# EAGLE design SimulatorT2GenericSensorRevC (EAGLE 7.7.0)
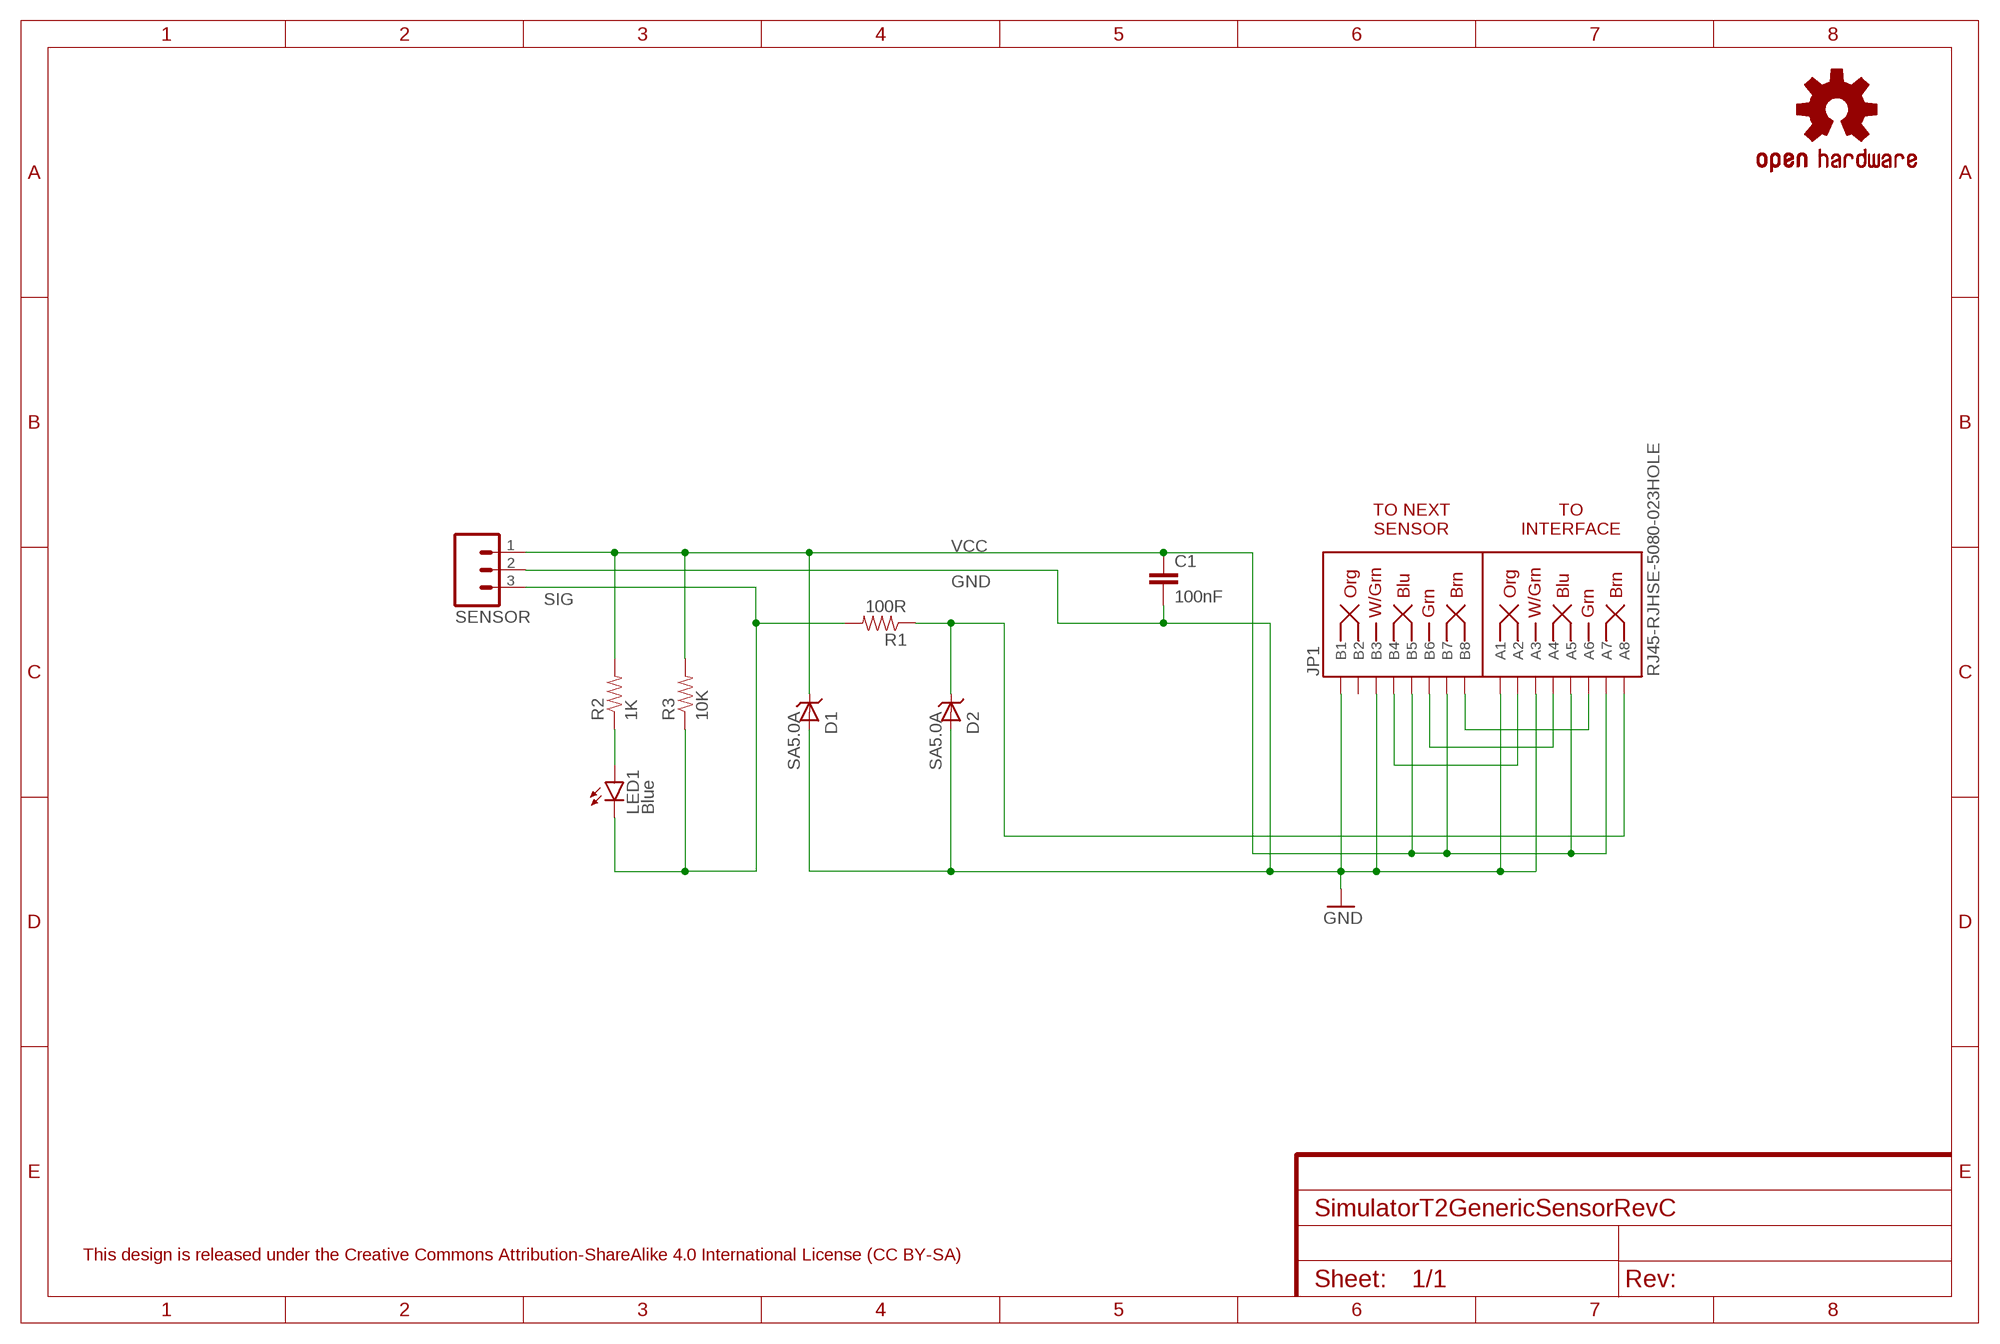
[diagram p0: schematic, sheet 1]
FRAME1 (FRAME-A4L): CNAME: Liverpool Simulator Type 2 Generic Sensor; CREVISION: Rev C 01/2018; DESIGNER: A J Instone-Cowie

## Parts
C1  100nF  CAPPTH  [CAP-PTH-SMALL]
D1  SA5.0A  [DO41_TVS_UNI]
D2  SA5.0A  [DO41_TVS_UNI]
JP1  RJ45-RJHSE-5080-023HOLE  [RJ45-RJHSE-5080-02-3HOLE]
LED1  Blue  LED3MM  [LED3MM]
LOGO1  OSHW-LOGOS  [OSHW-LOGO-S]
R1  100R  RESISTORPTH-1/4W  [AXIAL-0.4]
R2  1K  RESISTORPTH-1/4W  [AXIAL-0.4]
R3  10K  RESISTORPTH-1/4W  [AXIAL-0.4]
SENSOR  M03PTH  [1X03]

## Nets
!OUT!: D2.CATHODE JP1.A8 R1.P$1
B2: JP1.A6 JP1.B8
B3: JP1.A4 JP1.B6
B4: JP1.A2 JP1.B4
GND: C1.2 D1.ANODE D2.ANODE JP1.A1 JP1.A3 JP1.B1 JP1.B3 SENSOR.2
LED: LED1.A R2.P$1
SIG: LED1.K(C) R1.P$2 R3.P$1 SENSOR.3
VCC: C1.1 D1.CATHODE JP1.A5 JP1.A7 JP1.B5 JP1.B7 R2.P$2 R3.P$2 SENSOR.1
Unconnected: JP1.B2

## Notes on the sheet
- TO NEXT
  SENSOR
- TO
  INTERFACE
- This design is released under the Creative Commons Attribution-ShareAlike 4.0 International License (CC BY-SA)

## Library data of the parts
C1 = SparkFun-Passives:CAP: Capacitor Standard 0603 ceramic capacitor, and 0.1" leaded capacitor.
D1 D2 = AIC_Custom:SA5.0A: SA5.0CA TVS Uni-Directional Transient Voltage Suppressor. 5V, DO41 package
JP1 = AIC_Custom:RJ45-RJHSE-5080-02: Amphenol RJHSE-x080 RJ45 PCB Jack (2-Port) RJ45 8-pin connection PCB PTH connector, 2-Port 90 degree package 3 Hole variant has extra hole to allow a single port socket to fitted to position A if position B is not required.
LED1 = SparkFun-LED:LED: LEDs Standard schematic elements and footprints for 5mm, 3mm, 1206, and 0603 sized LEDs. 5mm - Spark Fun Electronics SKU : COM-00529 (and others)
LOGO1 = SparkFun-Aesthetics:OSHW-LOGO: Open Source Hardware Logo This logo indicates the piece of hardware it is found on incorporates a OSHW license and/or adheres to the definition of open source hardware found here: http://freedomdefined.org/OSHW
R1-R3 = SparkFun-Passives:RESISTOR: Resistor Basic schematic elements and footprints for 0603, 1206, and PTH resistors.
SENSOR = SparkFun-Connectors:M03: Header 3 Standard 3-pin 0.1" header. Use with straight break away headers (SKU : PRT-00116), right angle break away headers (PRT-00553), swiss pins (PRT-00743), machine pins (PRT-00117), and female headers (PRT-00115). Molex polarized connector foot print use with SKU : PRT-08232 with associated crimp pins and housings.

## Board
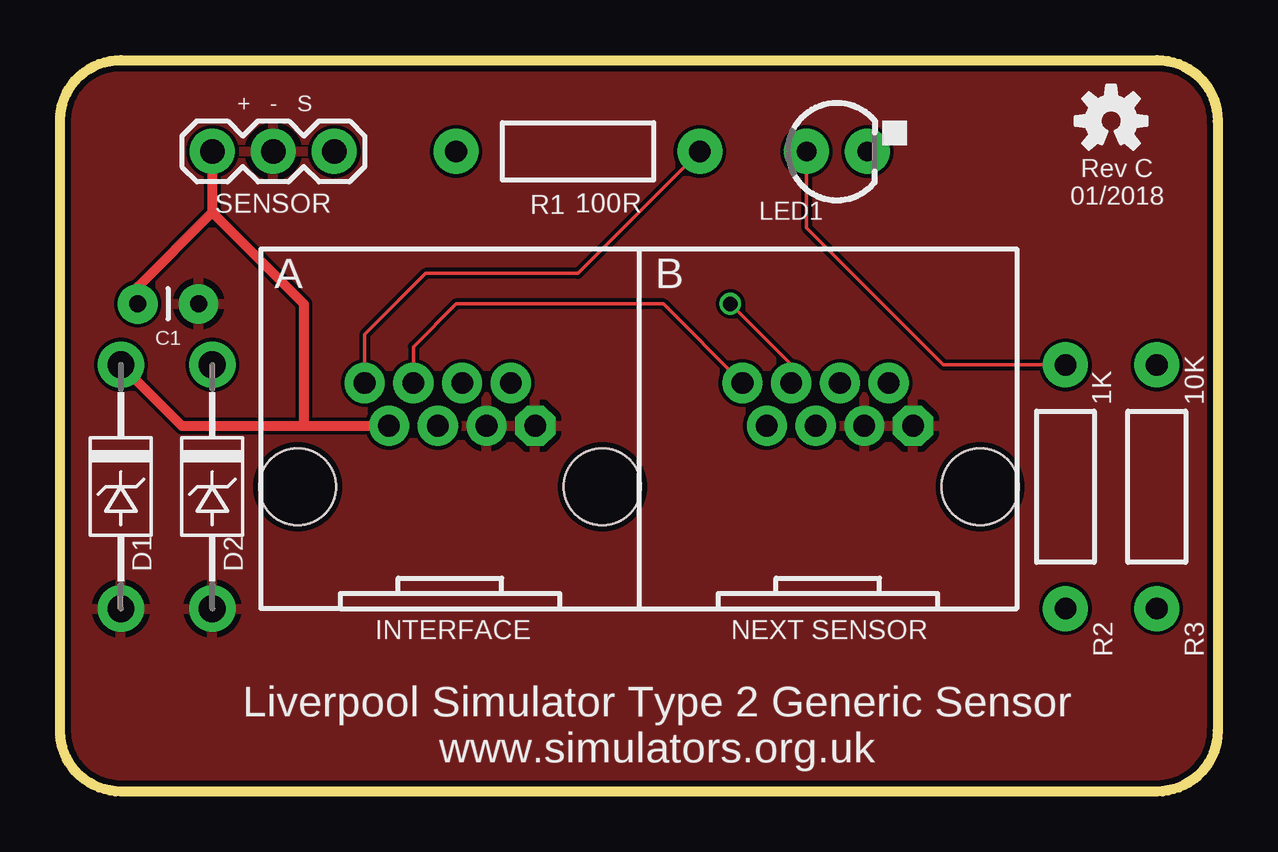
[diagram p1: board, top side]
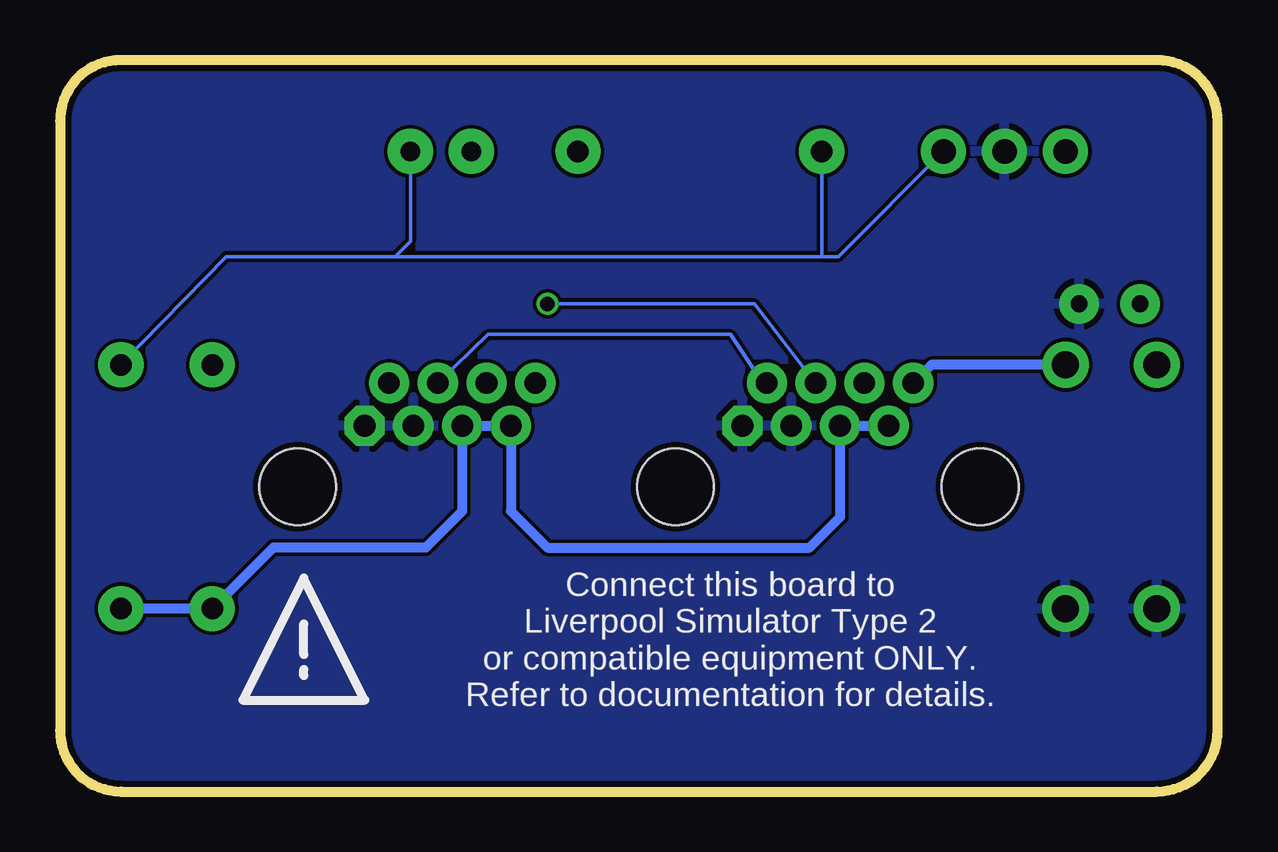
[diagram p2: board, bottom side, seen from below]

Size 48.26 x 30.48 mm. Coordinates in mm from the lower left corner, seen from the top.
Outline: 2.54,30.48 45.72,30.48 arc-90 48.26,27.94 48.26,2.54 arc-90 45.72,0 2.54,0 arc-90 0,2.54 0,27.94 arc-90 2.54,30.48
Copper layers (1*16): Top 0.035mm / dielectric 1.5mm / Bottom 0.035mm
Design rules "SeeedStudio_2layer_DRU_no_angle_20140221": minimum track width 6mil, minimum drill 12mil, track to track 6mil, track to pad 6mil, pad to pad 6mil, via to via 6mil, smd to smd 0mil, copper to edge 10mil, drill to drill 10mil, minimum pad ring 10mil, minimum via ring 6mil, stop-mask expansion 2mil, vias tented up to drill 100mil, thermal gap 10mil

### Footprints (pad centres in the part's own frame; a part is rotated, then mirrored left to right if it is on the bottom)
CAP-PTH-SMALL = drill 0.7 pad 1.651: 1 0,0; 2 2.54,0
DO41_TVS_UNI = drill 1.118 pad 1.93: ANODE -5.08,0; CATHODE 5.08,0
RJ45-RJHSE-5080-02-3HOLE = drill 0.9 pad 1.676 octagon: A1 -4.318,2.54; B1 11.43,2.54 | drill 0.9 pad 1.676: A2 -5.334,4.318; A3 -6.35,2.54; A4 -7.366,4.318; A5 -8.382,2.54; A6 -9.398,4.318; A7 -10.414,2.54; A8 -11.43,4.318; B2 10.414,4.318; B3 9.398,2.54; B4 8.382,4.318; B5 7.366,2.54; B6 6.35,4.318; B7 5.334,2.54; B8 4.318,4.318 | hole 3.2: -14.224,0; 14.224,0; -1.524,0
LED3MM = drill 0.813 pad 1.88: A -1.27,0; K 1.27,0
AXIAL-0.4 = drill 0.9 pad 1.88: P$1 -5.08,0; P$2 5.08,0
1X03 = drill 1.016 pad 1.88: 1 0,0; 2 2.54,0; 3 5.08,0

### Placement (x,y rotation side)
C1  3.24,20.32 0 top
D1  2.54,12.7 90 top
D2  6.35,12.7 90 top
JP1  24.13,12.7 0 top
LED1  32.38,26.67 0 top
LOGO1  43.81,27.94 0 top
R1  21.59,26.67 180 top
R2  41.91,12.7 270 top
R3  45.72,12.7 270 top
SENSOR  6.35,26.67 0 top
U$1  [WARNING_TRIANGLE_TPLACE]  38.1,3.81 0 bottom

### Tracks (layer width: path | path; a pad name or v marks a point on that pad's centre or on a via)
!OUT!
  Top 0.152: R1.P$1 21.59,21.59 15.24,21.59 12.7,19.05 JP1.A8
  Bottom 0.152: 12.7,17.14 JP1.A8
  Bottom 0.406: D2.CATHODE 11.94,17.78 JP1.A8
B2
  Top 0.152: JP1.B8 25.15,20.32 16.51,20.32 14.73,18.54 JP1.A6
B3  (via drill 0.6 pad 0.25)
  Top 0.152: v27.94,20.32 30.48,17.78 JP1.B6
  Bottom 0.152: JP1.A4 19.3,20.32 v27.94,20.32
B4
  Bottom 0.152: JP1.B4 30.42,19.05 20.32,19.05 19.05,17.14 JP1.A2
GND
  pour Top: 2.54,30.48 45.72,30.48 arc-90 48.26,27.94 48.26,2.54 arc-90 45.72,0 2.54,0 arc-90 0,2.54 0,27.94 arc-90
  pour Bottom: 2.54,30.48 45.72,30.48 arc-90 48.26,27.94 48.26,2.54 arc-90 45.72,0 2.54,0 arc-90 0,2.54 0,27.94 arc-90
LED
  Top 0.152: LED1.A 31.11,23.5 36.83,17.78 R2.P$1
SIG
  Bottom 0.152: 16.51,22.29 34.29,22.29 | R1.P$2 16.51,22.29 | 34.29,22.29 41.34,22.29 R3.P$1 | LED1.K 33.66,22.92 34.29,22.29 | 16.51,22.29 15.81,22.29 SENSOR.3
VCC
  Top 0.406: 10.16,15.24 JP1.A7 | 10.16,15.24 10.16,20.32 6.35,24.13 | D1.CATHODE 5.08,15.24 10.16,15.24 | SENSOR.1 6.35,24.13 | C1.1 3.24,21.02 6.35,24.13
  Bottom 0.406: JP1.A7 JP1.A5 15.75,11.43 17.02,10.16 27.94,10.16 29.46,11.68 JP1.B7 JP1.B5 31.5,11.68 33.02,10.16 39.37,10.16 R2.P$2 R3.P$2

### Text on the board
tPlace: + - S | Rev C / 01/2018 | INTERFACE | NEXT SENSOR | Liverpool Simulator Type 2 Generic Sensor / www.simulators.org.uk
bPlace: Connect this board to / Liverpool Simulator Type 2 / or compatible equipment ONLY. / Refer to documentation for details.